# Altium project HSLink.PrjPCB
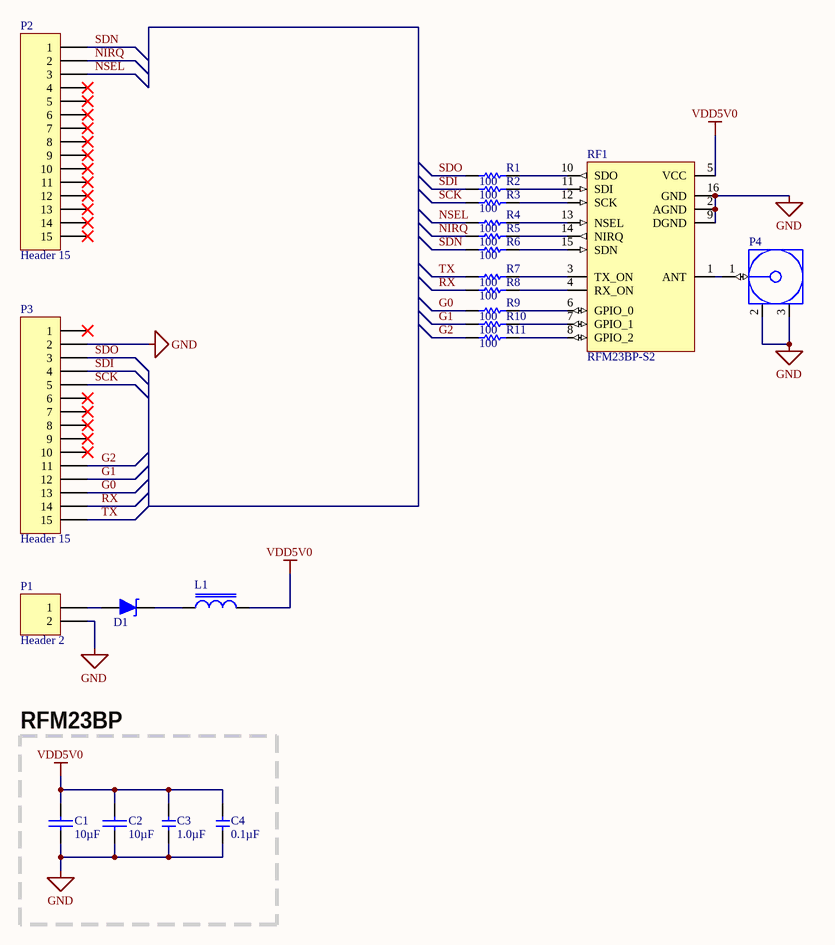
[diagram p0: Standalone.SchDoc]
1 sheet, 22 parts. Net scope: global (net labels, ports and power ports of the same name join across sheets).
Board file: Standalone.PcbDoc

## Sheet Standalone.SchDoc
size A4

### Parts
C1  Capacitance: 10µF  [1206_CAP]  (hidden comment: CAP CER 10UF 25V 10% X5R 1206)
C2  Capacitance: 10µF  [1206_CAP]  (hidden comment: CAP CER 10UF 25V 10% X5R 1206)
C3  Capacitance: 1.0µF  [0603_CAP]  (hidden comment: CAP CER 1UF 16V 10% X7R 0603)
C4  Capacitance: 0.1µF  [0603_CAP]  (hidden comment: CAP CER 0.1UF 16V 10% X7R 0603)
D1  PMEG2020AEA,115  [SOD323 (SC76)]  (value not drawn)
L1  FERRITE CHIP 180 OHM 2A 0603  [0603]  (value not drawn)
P1  Header 2  [HDR1X2]
P2  Header 15  [HDR1X15]
P3  Header 15  [HDR1X15]
P4  MULTICOMP - 19-70-TGG - JACK SMA, END LAUNCH  [SMA Connector]  (value not drawn)
R1  Resistance (Ohms): 100  [0402]  (hidden comment: Stackpole Electronics Inc)
R2  Resistance (Ohms): 100  [0402]  (hidden comment: Stackpole Electronics Inc)
R3  Resistance (Ohms): 100  [0402]  (hidden comment: Stackpole Electronics Inc)
R4  Resistance (Ohms): 100  [0402]  (hidden comment: Stackpole Electronics Inc)
R5  Resistance (Ohms): 100  [0402]  (hidden comment: Stackpole Electronics Inc)
R6  Resistance (Ohms): 100  [0402]  (hidden comment: Stackpole Electronics Inc)
R7  Resistance (Ohms): 100  [0402]  (hidden comment: Stackpole Electronics Inc)
R8  Resistance (Ohms): 100  [0402]  (hidden comment: Stackpole Electronics Inc)
R9  Resistance (Ohms): 100  [0402]  (hidden comment: Stackpole Electronics Inc)
R10  Resistance (Ohms): 100  [0402]  (hidden comment: Stackpole Electronics Inc)
R11  Resistance (Ohms): 100  [0402]  (hidden comment: Stackpole Electronics Inc)
RF1  RFM23BP-S2  [RFM23BP-S2]

### Blocks framed on the sheet
RFM23BP: C1-C4

### Nets
GND: C1.2 C2.2 C3.2 C4.2 P1.2 P3.2 P4.2(GND) P4.3(GND) RF1.2(AGND) RF1.9(N.C) RF1.16(GND)
VDD5V0: C1.1 C2.1 C3.1 C4.1 L1.2 RF1.5(VCC)
G0: P3.13 R9.1
G1: P3.12 R10.1
G2: P3.11 R11.1
NIRQ: P2.2 R5.1
NSEL: P2.3 R4.1
RX: P3.14 R8.1
SCK: P3.5 R3.1
SDI: P3.4 R2.1
SDN: P2.1 R6.1
SDO: P3.3 R1.1
TX: P3.15 R7.1
NetD1_1: D1.1(C) L1.1
NetD1_2: D1.2(A) P1.1
NetP4_1: P4.1(Signal) RF1.1(N.C)
NetR1_2: R1.2 RF1.10(SDO)
NetR2_2: R2.2 RF1.11(SDI)
NetR3_2: R3.2 RF1.12(SCK)
NetR4_2: R4.2 RF1.13(NSEL)
NetR5_2: R5.2 RF1.14(N.C)
NetR6_2: R6.2 RF1.15(SDN)
NetR7_2: R7.2 RF1.3(TX_ON)
NetR8_2: R8.2 RF1.4(N.C)
NetR9_2: R9.2 RF1.6(GPIO_0)
NetR10_2: R10.2 RF1.7(GPIO_1)
NetR11_2: R11.2 RF1.8(N.C)

Not connected (* = marked no-connect by the designer): P2 4* 5* 6* 7* 8* 9* 10* 11* 12* 13* 14* 15*; P3 1* 6* 7* 8* 9* 10*

### Library data of the parts
C1 C2 = GRM31CR61E106KA12L: Manufacturer: Murata Electronics North America; Supplier 1: Digi-Key; Manufacturer Part Number: GRM31CR61E106KA12L; RoHS: RoHS Compliant; Category: Capacitors; Stock 1: 278592; Pricing 1: 1=0.54, 10=0.449, 50=0.2524, 100=0.2245, 250=0.1684, 500=0.1487, 1000=0.13187 (EUR); Voltage - Rated: 25V; Tolerance: ±10%; Temperature Coefficient: X5R; Mounting Type: Surface Mount, MLCC; Operating Temperature: -55°C ~ 85°C; Applications: General Purpose; Ratings: -; Package / Case: 1206 (3216 Metric); Size / Dimension: 0.126" L x 0.063" W (3.20mm x 1.60mm); Height - Seated (Max): -; Thickness (Max): 0.071" (1.80mm); Lead Spacing: -; Features: -; Packaging: Cut Tape (CT); Lead Style: -; ComponentLink1URL: http://www.murata.com/products/catalog/pdf/c02e.pdf; ComponentLink1Description: http://www.murata.com/products/catalog/pdf/c02e.pdf; Supplier Part Number 1: 490-3373-1-ND
C3 = C0603C105K4RACTU: Manufacturer: Kemet; Supplier 1: Digi-Key; Manufacturer Part Number: C0603C105K4RACTU; RoHS: RoHS Compliant; Category: Capacitors; Stock 1: 105172; Pricing 1: 1=0.17, 10=0.117, 50=0.0708, 100=0.0594, 250=0.04812, 500=0.04244, 1000=0.03608 (EUR); Voltage - Rated: 16V; Tolerance: ±10%; Temperature Coefficient: X7R; Mounting Type: Surface Mount, MLCC; Operating Temperature: -55°C ~ 125°C; Applications: General Purpose; Ratings: -; Package / Case: 0603 (1608 Metric); Size / Dimension: 0.063" L x 0.031" W (1.60mm x 0.80mm); Height - Seated (Max): -; Thickness (Max): 0.035" (0.90mm); Lead Spacing: -; Features: -; Packaging: Cut Tape (CT); Lead Style: -; ComponentLink1URL: http://www.kemet.com/datasheets&C0603C105K4RACTU; ComponentLink1Description: http://www.kemet.com/datasheets&C0603C105K4RACTU; Supplier Part Number 1: 399-7847-1-ND
C4 = C0603C104K4RACTU: Manufacturer: Kemet; Supplier 1: Digi-Key; Manufacturer Part Number: C0603C104K4RACTU; RoHS: RoHS Compliant; Category: Capacitors; Stock 1: 3983964; Pricing 1: 1=0.08, 10=0.018, 50=0.01, 100=0.0083, 250=0.00684, 500=0.00584, 1000=0.00454 (EUR); Voltage - Rated: 16V; Tolerance: ±10%; Temperature Coefficient: X7R; Mounting Type: Surface Mount, MLCC; Operating Temperature: -55°C ~ 125°C; Applications: General Purpose; Ratings: -; Package / Case: 0603 (1608 Metric); Size / Dimension: 0.063" L x 0.031" W (1.60mm x 0.80mm); Height - Seated (Max): -; Thickness (Max): 0.034" (0.87mm); Lead Spacing: -; Features: -; Packaging: Cut Tape (CT); Lead Style: -; ComponentLink1URL: http://www.kemet.com/datasheets&C0603C104K4RACTU; ComponentLink1Description: http://www.kemet.com/datasheets&C0603C104K4RACTU; Supplier Part Number 1: 399-1096-1-ND
D1 = PMEG2020AEA,115: SCHOTTKY RECT 20V 2A SOD323; Manufacturer: NXP Semiconductors; Current - Average Rectified (Io): 2A (DC); Voltage - Forward (Vf) (Max) @ If: 525mV @ 2A; Speed: Fast Recovery =< 500ns, > 200mA (Io); Current - Reverse Leakage @ Vr: 200µA @ 20V; Capacitance @ Vr, F: 70pF @ 5V, 1MHz; Supplier 1: Digi-Key; Manufacturer Part Number: PMEG2020AEA,115; RoHS: RoHS Compliant; Category: Discrete Semiconductor Products; Stock 1: 8130; Pricing 1: 1=0.39, 10=0.309, 25=0.2616, 100=0.2129, 250=0.1764, 500=0.1457, 1000=0.10913 (EUR); Diode Type: Schottky; Voltage - DC Reverse (Vr) (Max): 20V; Reverse Recovery Time (trr): -; Mounting Type: Surface Mount; Package / Case: SC-76, SOD-323; Supplier Device Package: SOD-323; Packaging: Cut Tape (CT); ComponentLink1URL: http://www.nxp.com/documents/data_sheet/PMEG2020AEA.pdf; ComponentLink1Description: http://www.nxp.com/documents/data_sheet/PMEG2020AEA.pdf; Supplier Part Number 1: 568-6505-1-ND
L1 = MPZ1608S181A: Manufacturer: TDK Corporation; Impedance @ Frequency: 180 Ohm @ 100MHz; DC Resistance (DCR): 50 mOhm Max; Filter Type: Differential Mode - Single; Supplier 1: Digi-Key; Manufacturer Part Number: MPZ1608S181A; RoHS: RoHS Compliant; Category: Filters; Stock 1: 111547; Pricing 1: 1=0.08, 10=0.062, 100=0.0371, 250=0.02692, 500=0.02468, 1000=0.02132 (EUR); Current Rating: 2A; Package / Case: 0603 (1608 Metric); Mounting Type: Surface Mount; Packaging: Cut Tape (CT); Height (Max): 0.030" (0.75mm); Size / Dimension: 0.063" L x 0.031" W (1.60mm x 0.80mm); ComponentLink1URL: http://www.tdk.co.jp/tefe02/e9413_mpz.pdf; ComponentLink1Description: http://www.tdk.co.jp/tefe02/e9413_mpz.pdf; Supplier Part Number 1: 445-5220-1-ND
P1 = Header 2: Header, 2-Pin; LatestRevisionDate: 17-Jul-2002; LatestRevisionNote: Re-released for DXP Platform.; Publisher: Altium Limited
P2 P3 = Header 15: CONN HEADER FEMALE 15POS.1" TIN; LatestRevisionDate: 17-Jul-2002; LatestRevisionNote: Re-released for DXP Platform.; Publisher: Altium Limited; Digikey: S7013-ND
P4 = 19-70-TGG: Supplier 1: Farnell; Manufacturer: MULTICOMP; Manufacturer Part Number: 19-70-TGG; RoHS: Y-EX; Stock 1: 56501; Pricing 1: 1=44,19, 10=36,16, 50=31,46 (SEK); ComponentLink1URL: http://www.farnell.com/datasheets/1661812.pdf; ComponentLink1Description: http://www.farnell.com/datasheets/1661812.pdf; Supplier Part Number 1: 1342651
R1-R11 = RMCF0402FT100R: RES 100 OHM 1/16W 1% 0402 SMD; Power (Watts): 0.063W, 1/16W; Temperature Coefficient: ±100ppm/°C; Supplier 1: Digi-Key; Manufacturer: Stackpole Electronics Inc; Manufacturer Part Number: RMCF0402FT100R; RoHS: RoHS Compliant; Category: Resistors; Stock 1: 66424; Pricing 1: 1=0.03, 10=0.021, 50=0.0116, 100=0.0088, 250=0.00656, 500=0.00484, 1000=0.00323, 2500=0.00272, 5000=0.00227 (EUR); Composition: Thick Film; Features: -; Tolerance: ±1%; Package / Case: 0402 (1005 Metric); Supplier Device Package: 0402; Size / Dimension: 0.039" L x 0.020" W (1.00mm x 0.50mm); Height: 0.016" (0.40mm); Number of Terminations: 2; Packaging: Cut Tape (CT); ComponentLink1URL: http://www.seielect.com/Catalog/SEI-RMCF_RMCP.pdf; ComponentLink1Description: http://www.seielect.com/Catalog/SEI-RMCF_RMCP.pdf; Supplier Part Number 1: RMCF0402FT100RCT-ND
RF1 = RFM23BP-S2: UHF 1W Transceiver